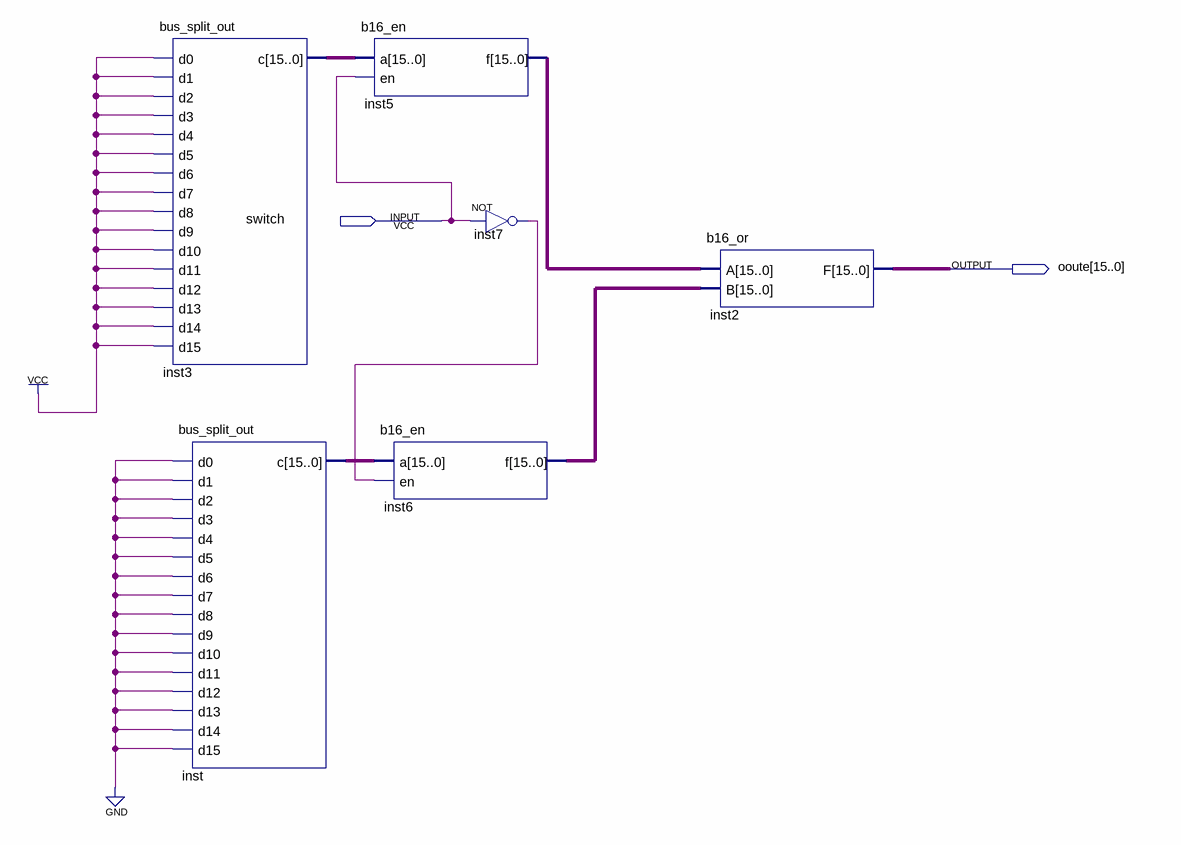
[diagram p0: schematic sheet]
// Quartus schematic constt.bdf as structural Verilog: 6 symbols, 2 pins
module constt (
  input  switch,
  output [15:0] ooute
);

  wire inst7_out;
  wire [15:0] inst3_c, inst5_f, inst6_f, inst_c;

  bus_split_out inst3 (
    .d0(1'b1), .d1(1'b1), .d2(1'b1), .d3(1'b1), .d4(1'b1), .d5(1'b1), .d6(1'b1), .d7(1'b1), .d8(1'b1),
    .d9(1'b1), .d10(1'b1), .d11(1'b1), .d12(1'b1), .d13(1'b1), .d14(1'b1), .d15(1'b1), .c(inst3_c));
  bus_split_out inst (
    .d0(1'b0), .d1(1'b0), .d2(1'b0), .d3(1'b0), .d4(1'b0), .d5(1'b0), .d6(1'b0), .d7(1'b0), .d8(1'b0),
    .d9(1'b0), .d10(1'b0), .d11(1'b0), .d12(1'b0), .d13(1'b0), .d14(1'b0), .d15(1'b0), .c(inst_c));
  b16_en inst5 (.a(inst3_c), .en(switch), .f(inst5_f));
  b16_en inst6 (.a(inst_c), .en(inst7_out), .f(inst6_f));
  not inst7 (inst7_out, switch);
  b16_or inst2 (.A(inst5_f), .B(inst6_f), .F(ooute));
endmodule
